# EAGLE design Teensy + MD (EAGLE 9.6.1)
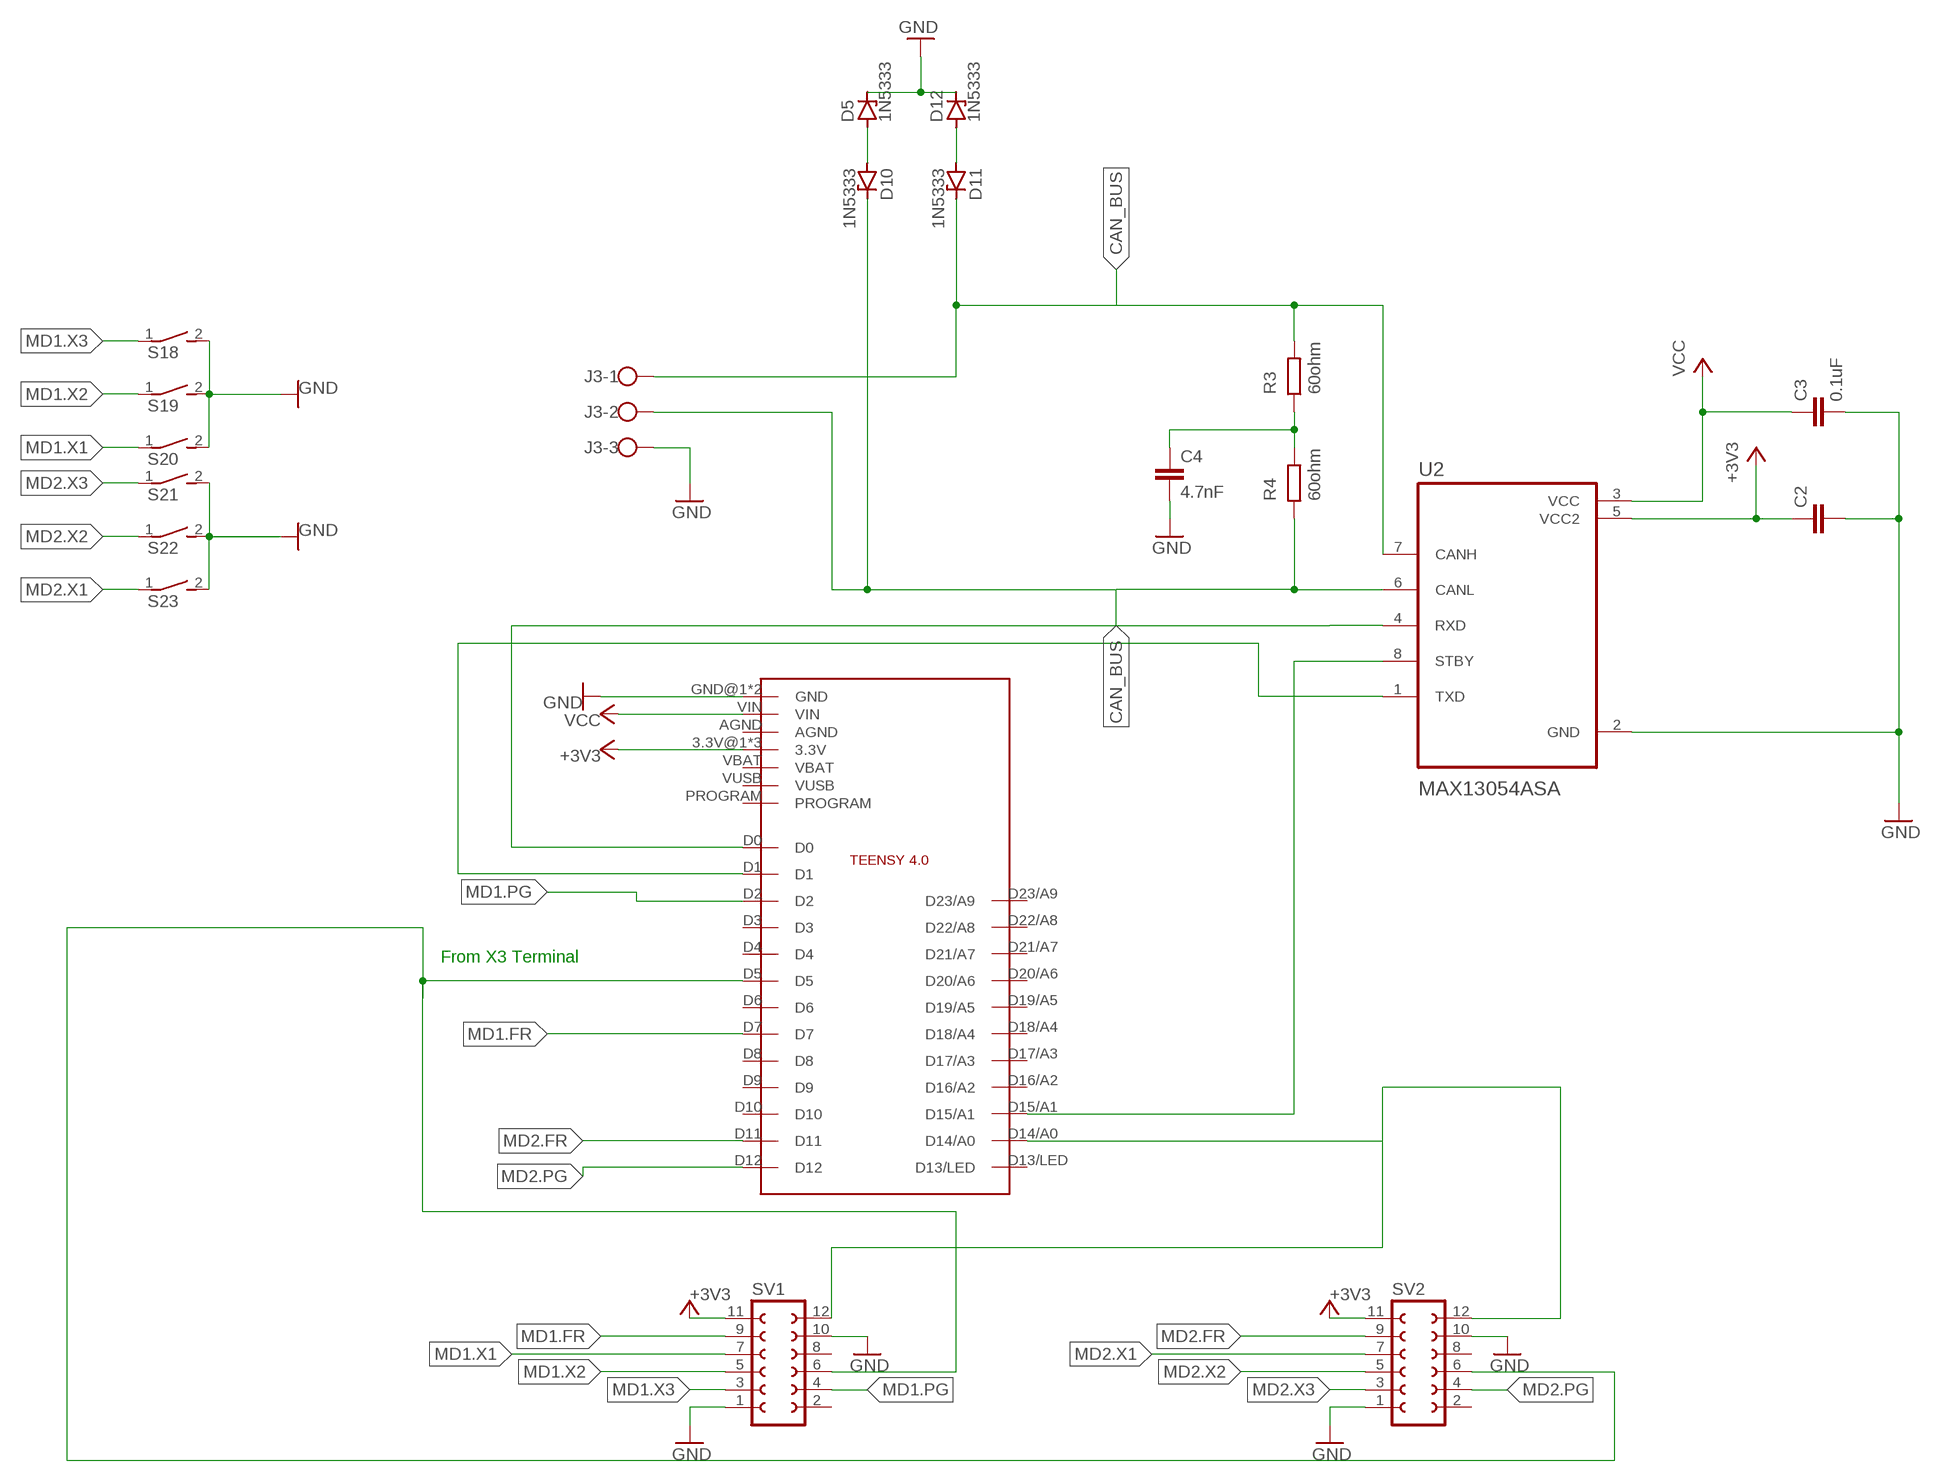
[diagram p0: schematic, sheet 1]

## Parts
C2  C2,5-3  [C2.5-3]
C3  0.1uF  C2,5-3  [C2.5-3]
C4  4.7nF  C2,5-3  [C2.5-3]
D5  1N5333  [C1702-15]
D10  1N5333  [C1702-15]
D11  1N5333  [C1702-15]
D12  1N5333  [C1702-15]
J3  W237-103  [W237-103]
R3  60ohm  R  (no package)
R4  60ohm  R  (no package)
S18  DS01E  [DS-01]
S19  DS01E  [DS-01]
S20  DS01E  [DS-01]
S21  DS01E  [DS-01]
S22  DS01E  [DS-01]
S23  DS01E  [DS-01]
SV1  FE06-2  [FE06-2]
SV2  FE06-2  [FE06-2]
U2  MAX13054ASA  [SOIC127P600X175-8N]
U$3  TEENSY4.0  [TEENSY4.0]

## Nets
+3V3: C2.1 SV1.11 SV2.11 U2.5(VCC2) U$3.3.3V@1(3.3V) U$3.3.3V@2(3.3V) U$3.ON/OFF(3.3V)
CAN_BUS: D11.C J3.1 R3.2 U2.7(CANH)
GND: C2.2 C3.2 C4.2 D5.C D12.C J3.3 S18.2 S19.2 S20.2 S21.2 S22.2 S23.2 SV1.1 SV1.10 SV2.1 SV2.10 U2.2(GND) U$3.GND@1(GND) U$3.GND@2(GND)
MD1.5V: SV1.6 SV2.6 U$3.D5
MD1.FR: SV1.9 U$3.D7
MD1.PG: SV1.4 U$3.D2
MD1.X1: S20.1 SV1.7
MD1.X2: S19.1 SV1.5
MD1.X3: S18.1 SV1.3
MD2.BK: SV1.12 SV2.12 U$3.D14/A0
MD2.FR: SV2.9 U$3.D11
MD2.PG: SV2.4 U$3.D12
MD2.X1: S23.1 SV2.7
MD2.X2: S22.1 SV2.5
MD2.X3: S21.1 SV2.3
N$9: D10.C J3.2 R4.1 U2.6(CANL)
N$10: U2.8(STBY) U$3.D15/A1
N$11: U2.4(RXD) U$3.D0
N$12: U2.1(TXD) U$3.D1
N$13: C4.1 R3.1 R4.2
N$14: D5.A D10.A
N$15: D11.A D12.A
VCC: C3.1 U2.3(VCC) U$3.VIN
Unconnected: SV1.2 SV1.8 SV2.2 SV2.8 U$3.AGND U$3.D3 U$3.D4 U$3.D6 U$3.D8 U$3.D9 U$3.D10 U$3.D13/LED U$3.D16/A2 U$3.D17/A3 U$3.D18/A4 U$3.D19/A5 U$3.D20/A6 U$3.D21/A7 U$3.D22/A8 U$3.D23/A9 U$3.PROGRAM U$3.VBAT U$3.VUSB

## Notes on the sheet
- From X3 Terminal

## Library data of the parts
C2-C4 = capacitor-wima:C: CAPACITOR naming: grid - package width
D5 D10-D12 = diode:1N5333: Z DIODE 3.3 V, 5W, 5 percent (Motorola)
J3 = con-wago-500:W237-103: WAGO SCREW CLAMP; MPN: 237-103; OC_FARNELL: unknown; OC_NEWARK: 18M7116
R3 R4 = ngspice-simulation:R: RESISTOR
S18-S23 = switch-dil:DS01E: DIL/CODE SWITCH; OC_FARNELL: unknown; OC_NEWARK: unknown
SV1 SV2 = con-lsta:FE06-2: FEMALE HEADER; OC_FARNELL: unknown; OC_NEWARK: unknown
U2 = MAX13054ASA:MAX13054ASA; DESCRIPTION: 1/1 Transceiver Full CANbus 8-SOIC; DIGI-KEY_PART_NUMBER: MAX13054ASA+TTR-ND; DIGI-KEY_PURCHASE_URL: https://www.digikey.com/product-detail/en/maxim-integrated/MAX13054ASA-T/MAX13054ASA-TTR-ND/1475460?utm_source=snapeda&utm_medium=aggregator&utm_campaign=symbol; MF: Maxim Integrated; MP: MAX13054ASA+; PACKAGE: SOIC-8 Maxim
U$3 = Teensy4.0:TEENSY4.0

## Module RESISTER
Ports: 

### Library data of the parts

## Module GND
Ports: 

### Library data of the parts

## Module MOTOR
Ports: 

### Library data of the parts

## Module MOTORDRIVER
Ports: U(io) V(io) W(io) VCC(io) GND(io) 5V(io) GND1(io) HA(io) HB(io) HC(io) RS232(io) PWR(io) ALM(io) GND2(io) ALM1(io) X3(io) PG(io) X2(io) 5V1(io) X1(io) 5V2(io) PR(io) GND3(io) EN(io) BR(io)

### Library data of the parts

## Board
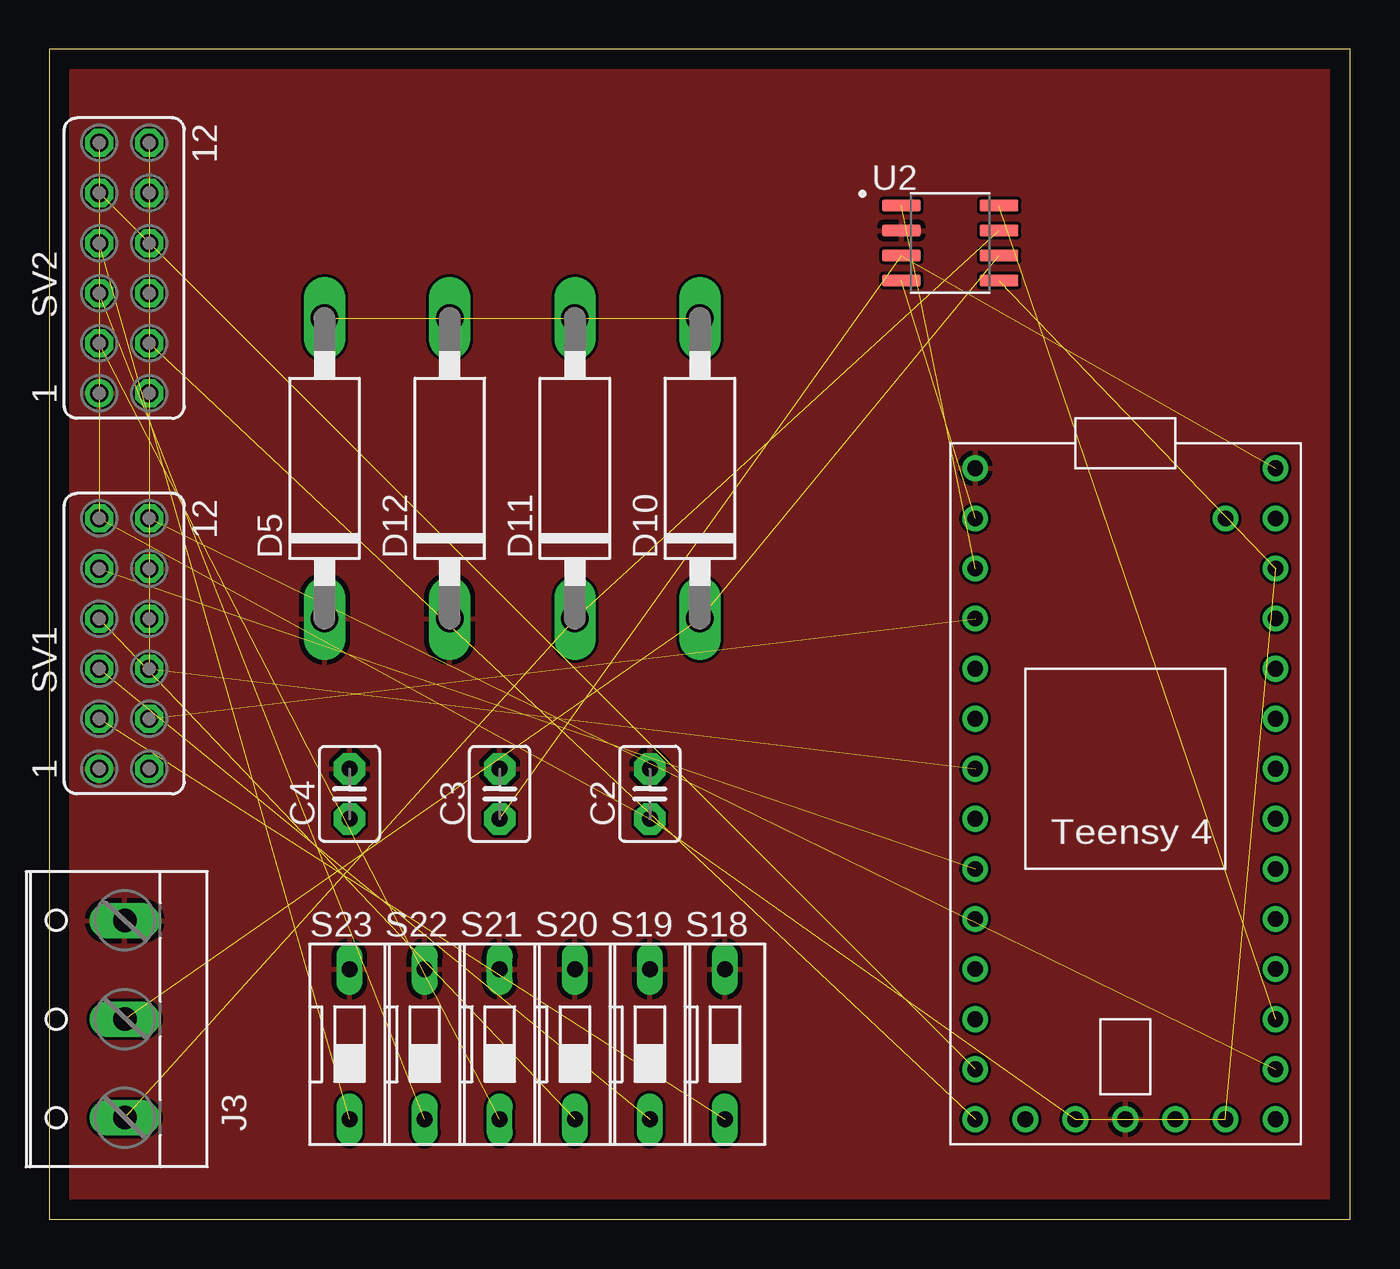
[diagram p1: board, top side]

Size 66.02 x 59.36 mm. Coordinates in mm from the lower left corner, seen from the top.
Outline: 0,0 66.02,0 66.02,59.36 0,59.36 0,0
Copper layers (1*16): Top 0.035mm / dielectric 1.5mm / Bottom 0.035mm
Design rules "default": minimum track width 6mil, minimum drill 0.35mm, track to track 6mil, track to pad 6mil, pad to pad 6mil, via to via 6mil, smd to smd 6mil, copper to edge 40mil, drill to drill 6mil, minimum pad ring 10mil, minimum via ring 8mil, stop-mask expansion 4mil, vias tented up to drill 0mil, thermal gap 10mil

### Footprints (pad centres in the part's own frame; a part is rotated, then mirrored left to right if it is on the bottom)
C2.5-3 = drill 0.813 pad 1.6 octagon: 1 -1.27,0; 2 1.27,0
C1702-15 = drill 1.397 long: A 7.62,0; C -7.62,0
W237-103 = drill 1.194 long: 1 -5,-1.29; 2 0,-1.29; 3 5,-1.29
DS-01 = drill 0.813 long: 1 0,-3.81; 2 0,3.81
FE06-2 = drill 0.914: 1 -6.35,1.27 | drill 0.914 octagon: 2 -6.35,-1.27; 3 -3.81,1.27; 4 -3.81,-1.27; 5 -1.27,1.27; 6 -1.27,-1.27; 7 1.27,1.27; 8 1.27,-1.27; 9 3.81,1.27; 10 3.81,-1.27; 11 6.35,1.27; 12 6.35,-1.27
SOIC127P600X175-8N = smd 1.97 x 0.59: 1 -2.475,1.905; 2 -2.475,0.635; 3 -2.475,-0.635; 4 -2.475,-1.905; 5 2.475,-1.905; 6 2.475,-0.635; 7 2.475,0.635; 8 2.475,1.905
TEENSY4.0 = drill 0.8: 3.3V@1 7.62,10.16; 3.3V@2 -2.54,-17.78; AGND 7.62,12.7; D0 -7.62,12.7; D1 -7.62,10.16; D2 -7.62,7.62; D3 -7.62,5.08; D4 -7.62,2.54; D5 -7.62,0; D6 -7.62,-2.54; D7 -7.62,-5.08; D8 -7.62,-7.62; D9 -7.62,-10.16; D10 -7.62,-12.7; D11 -7.62,-15.24; D12 -7.62,-17.78; D13/LED 7.62,-17.78; D14/A0 7.62,-15.24; D15/A1 7.62,-12.7; D16/A2 7.62,-10.16; D17/A3 7.62,-7.62; D18/A4 7.62,-5.08; D19/A5 7.62,-2.54; D20/A6 7.62,0; D21/A7 7.62,2.54; D22/A8 7.62,5.08; D23/A9 7.62,7.62; GND@1 -7.62,15.24; GND@2 0,-17.78; ON/OFF 5.08,-17.78; PROGRAM 2.54,-17.78; VBAT -5.08,-17.78; VIN 7.62,15.24; VUSB 5.08,12.7

### Placement (x,y rotation side)
C2  30.48,21.59 90 top
C3  22.86,21.59 90 top
C4  15.24,21.59 90 top
D5  13.97,38.1 90 top
D10  33.02,38.1 90 top
D11  26.67,38.1 90 top
D12  20.32,38.1 90 top
J3  2.54,10.16 90 top
S18  34.29,8.89 0 top
S19  30.48,8.89 0 top
S20  26.67,8.89 0 top
S21  22.86,8.89 0 top
S22  19.05,8.89 0 top
S23  15.24,8.89 0 top
SV1  3.81,29.21 90 top
SV2  3.81,48.26 90 top
U2  45.72,49.53 0 top
U$3  54.61,22.86 0 top

### Tracks (layer width: path | path; a pad name or v marks a point on that pad's centre or on a via)
+3V3  (6 unrouted)
CAN_BUS  (2 unrouted)
GND
  pour Top: -1.27,60.96 -1.27,-1.27 67.31,-1.27 67.31,60.96
MD1.5V  (2 unrouted)
MD1.FR  (1 unrouted)
MD1.PG  (1 unrouted)
MD1.X1  (1 unrouted)
MD1.X2  (1 unrouted)
MD1.X3  (1 unrouted)
MD2.BK  (2 unrouted)
MD2.FR  (1 unrouted)
MD2.PG  (1 unrouted)
MD2.X1  (1 unrouted)
MD2.X2  (1 unrouted)
MD2.X3  (1 unrouted)
N$9  (2 unrouted)
N$10  (1 unrouted)
N$11  (1 unrouted)
N$12  (1 unrouted)
N$14  (1 unrouted)
N$15  (1 unrouted)
VCC  (2 unrouted)